# Altium schematic sheet FPGA_NonIO.SchDoc: USER FPGA Pwr and Programming
size A4; Organization: Altium Limited.; Address1: Level 3, 12a Rodborough Rd; Address2: Frenchs Forest 2086; Address3: NSW; Address4: AUSTRALIA; DocumentNumber: 8; SheetNumber: 9; SheetTotal: 78
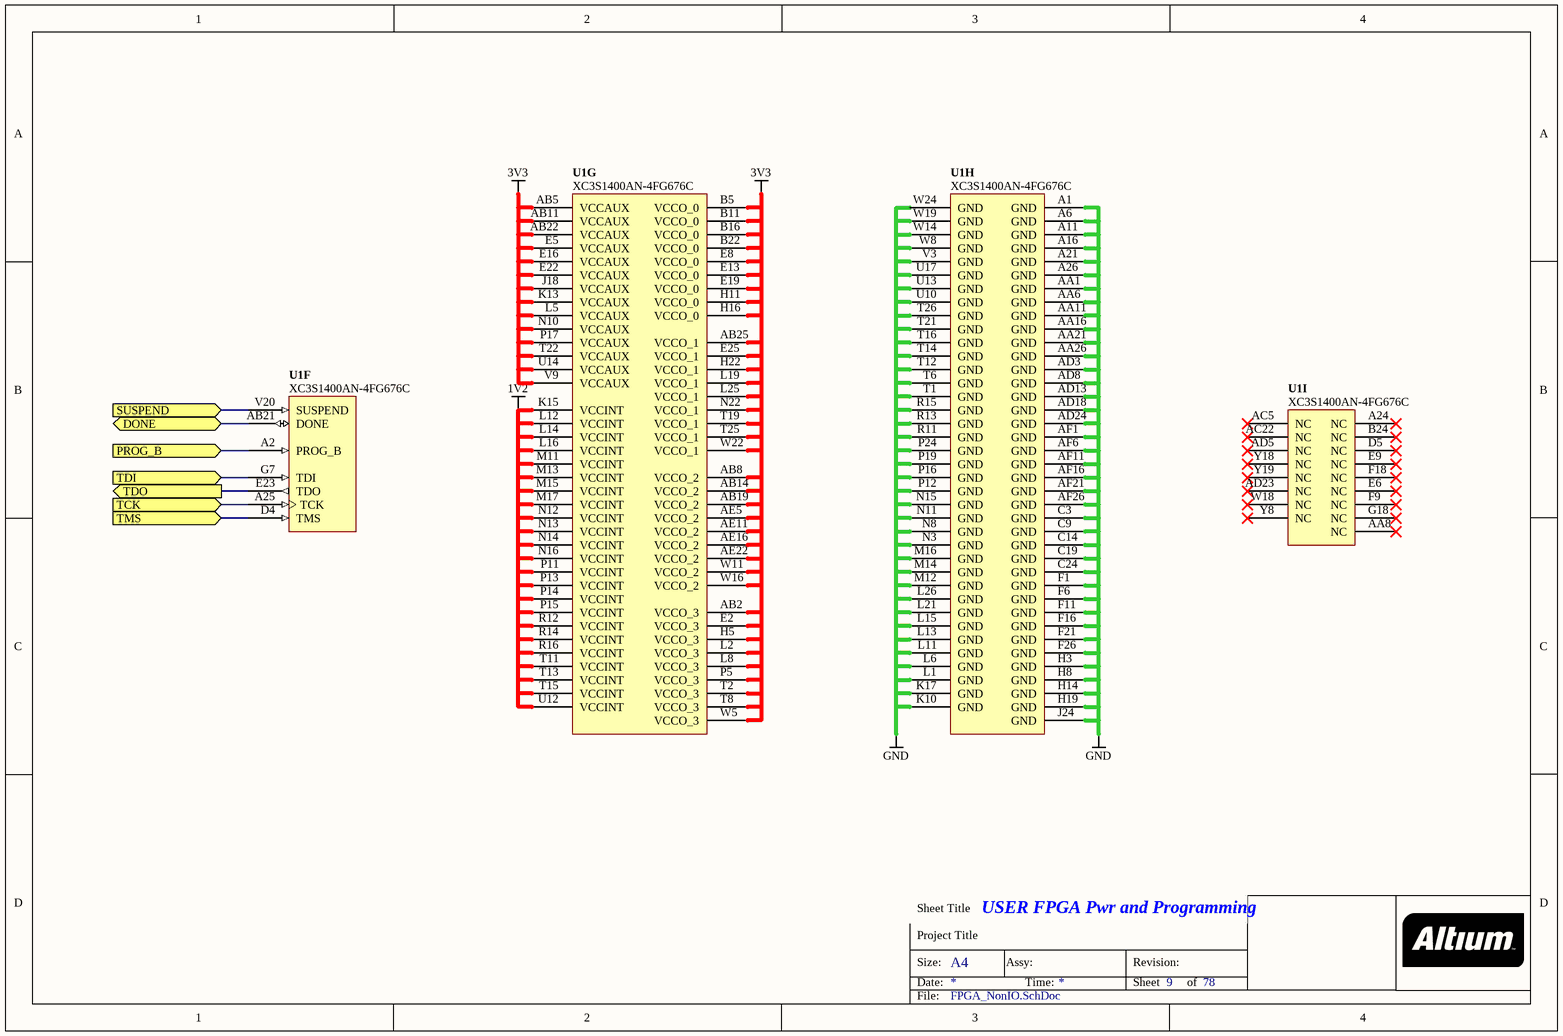
[diagram p0: FPGA_NonIO.SchDoc]

## Parts
U1  XC3S1400AN-4FG676C  [BGA100P26X26-676]  (parts F,G,H,I of 9)

## Ports
DONE (bidir), PROG_B (in), SUSPEND (in), TCK (in), TDI (in), TDO (out), TMS (in)

## Nets
1V2: U1.K15(VCCINT) U1.L12(VCCINT) U1.L14(VCCINT) U1.L16(VCCINT) U1.M11(VCCINT) U1.M13(VCCINT) U1.M15(VCCINT) U1.M17(VCCINT) U1.N12(VCCINT) U1.N13(VCCINT) U1.N14(VCCINT) U1.N16(VCCINT) U1.P11(VCCINT) U1.P13(VCCINT) U1.P14(VCCINT) U1.P15(VCCINT) U1.R12(VCCINT) U1.R14(VCCINT) U1.R16(VCCINT) U1.T11(VCCINT) U1.T13(VCCINT) U1.T15(VCCINT) U1.U12(VCCINT)
3V3: U1.AB2(VCCO_3) U1.AB5(VCCAUX) U1.AB8(VCCO_2) U1.AB11(VCCAUX) U1.AB14(VCCO_2) U1.AB19(VCCO_2) U1.AB22(VCCAUX) U1.AB25(VCCO_1) U1.AE5(VCCO_2) U1.AE11(VCCO_2) U1.AE16(VCCO_2) U1.AE22(VCCO_2) U1.B5(VCCO_0) U1.B11(VCCO_0) U1.B16(VCCO_0) U1.B22(VCCO_0) U1.E2(VCCO_3) U1.E5(VCCAUX) U1.E8(VCCO_0) U1.E13(VCCO_0) U1.E16(VCCAUX) U1.E19(VCCO_0) U1.E22(VCCAUX) U1.E25(VCCO_1) U1.H5(VCCO_3) U1.H11(VCCO_0) U1.H16(VCCO_0) U1.H22(VCCO_1) U1.J18(VCCAUX) U1.K13(VCCAUX) U1.L2(VCCO_3) U1.L5(VCCAUX) U1.L8(VCCO_3) U1.L19(VCCO_1) U1.L25(VCCO_1) U1.N10(VCCAUX) U1.N22(VCCO_1) U1.P5(VCCO_3) U1.P17(VCCAUX) U1.T2(VCCO_3) U1.T8(VCCO_3) U1.T19(VCCO_1) U1.T22(VCCAUX) U1.T25(VCCO_1) U1.U14(VCCAUX) U1.V9(VCCAUX) U1.W5(VCCO_3) U1.W11(VCCO_2) U1.W16(VCCO_2) U1.W22(VCCO_1)
GND: U1.A1(GND) U1.A6(GND) U1.A11(GND) U1.A16(GND) U1.A21(GND) U1.A26(GND) U1.AA1(GND) U1.AA6(GND) U1.AA11(GND) U1.AA16(GND) U1.AA21(GND) U1.AA26(GND) U1.AD3(GND) U1.AD8(GND) U1.AD13(GND) U1.AD18(GND) U1.AD24(GND) U1.AF1(GND) U1.AF6(GND) U1.AF11(GND) U1.AF16(GND) U1.AF21(GND) U1.AF26(GND) U1.C3(GND) U1.C9(GND) U1.C14(GND) U1.C19(GND) U1.C24(GND) U1.F1(GND) U1.F6(GND) U1.F11(GND) U1.F16(GND) U1.F21(GND) U1.F26(GND) U1.H3(GND) U1.H8(GND) U1.H14(GND) U1.H19(GND) U1.J24(GND) U1.K10(GND) U1.K17(GND) U1.L1(GND) U1.L6(GND) U1.L11(GND) U1.L13(GND) U1.L15(GND) U1.L21(GND) U1.L26(GND) U1.M12(GND) U1.M14(GND) U1.M16(GND) U1.N3(GND) U1.N8(GND) U1.N11(GND) U1.N15(GND) U1.P12(GND) U1.P16(GND) U1.P19(GND) U1.P24(GND) U1.R11(GND) U1.R13(GND) U1.R15(GND) U1.T1(GND) U1.T6(GND) U1.T12(GND) U1.T14(GND) U1.T16(GND) U1.T21(GND) U1.T26(GND) U1.U10(GND) U1.U13(GND) U1.U17(GND) U1.V3(GND) U1.W8(GND) U1.W14(GND) U1.W19(GND) U1.W24(GND)
DONE: U1.AB21(DONE) ; port DONE
PROG_B: U1.A2(PROG_B) ; port PROG_B
SUSPEND: U1.V20(SUSPEND) ; port SUSPEND
TCK: U1.A25(TCK) ; port TCK
TDI: U1.G7(TDI) ; port TDI
TDO: U1.E23(TDO) ; port TDO
TMS: U1.D4(TMS) ; port TMS

Not connected (* = marked no-connect by the designer): U1 A24(NC)* AA8(NC)* AC5(NC)* AC22(NC)* AD5(NC)* AD23(NC)* B24(NC)* D5(NC)* E6(NC)* E9(NC)* F9(NC)* F18(NC)* G18(NC)* W18(NC)* Y8(NC)* Y18(NC)* Y19(NC)*

## Notes on the sheet
- Sheet Title
- Project Title
- Size:
- Date:
- A4
- Assy:
- Time:
- Revision:
- Sheet
- of
- File:

## Library data of the parts
U1 = D-241-0015: FPGA, Xilinx Spartan 3AN-1400 FG676; Supply Voltage: mV; Mounting Technology: Surface Mount; Status: Unreleased; Technology: None; Category: IC-FPGA; NexusDeviceId: XC3S1400AN-4FG676C